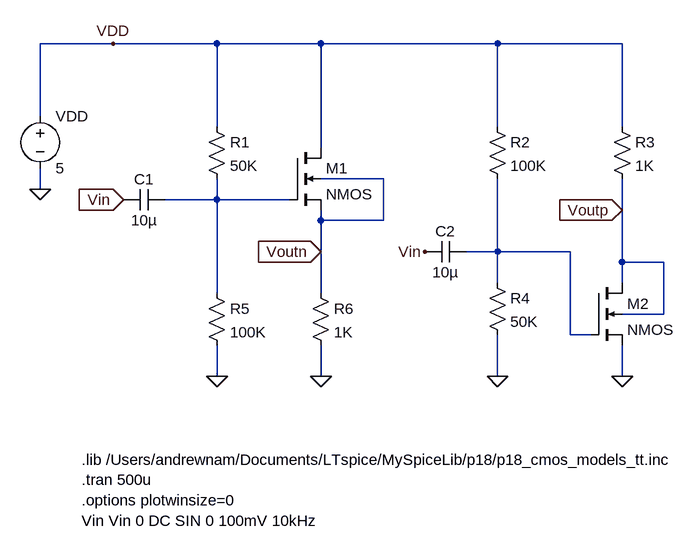
[diagram p0: schematic common_drain_amplifier.asc]
common_drain_amplifier.asc, the LTspice schematic file:
Version 4
SHEET 1 1116 800
WIRE 224 80 112 80
WIRE 384 80 224 80
WIRE 544 80 384 80
WIRE 816 80 544 80
WIRE 1008 80 816 80
WIRE 112 192 112 80
WIRE 384 208 384 80
WIRE 816 208 816 80
WIRE 1008 208 1008 80
WIRE 544 240 544 80
WIRE 640 288 544 288
WIRE 112 304 112 272
WIRE 384 320 384 288
WIRE 384 320 304 320
WIRE 496 320 384 320
WIRE 1008 336 1008 288
WIRE 544 352 544 336
WIRE 640 352 640 288
WIRE 640 352 544 352
WIRE 544 400 544 352
WIRE 816 400 816 288
WIRE 816 400 768 400
WIRE 928 400 816 400
WIRE 1008 416 1008 336
WIRE 1072 416 1008 416
WIRE 816 448 816 400
WIRE 1008 448 1008 416
WIRE 384 464 384 320
WIRE 544 464 544 400
WIRE 1072 496 1072 416
WIRE 1072 496 1008 496
WIRE 928 528 928 400
WIRE 960 528 928 528
WIRE 384 592 384 544
WIRE 544 592 544 544
WIRE 816 592 816 528
WIRE 1008 592 1008 544
FLAG 112 304 0
FLAG 384 592 0
FLAG 544 592 0
FLAG 816 592 0
FLAG 224 80 VDD
FLAG 1008 592 0
FLAG 240 320 Vin
IOPIN 240 320 In
FLAG 704 400 Vin
FLAG 1008 336 Voutp
IOPIN 1008 336 In
FLAG 544 400 Voutn
IOPIN 544 400 In
SYMBOL voltage 112 176 R0
SYMATTR InstName VDD
SYMATTR Value 5
SYMBOL res 368 192 R0
SYMATTR InstName R1
SYMATTR Value 50K
SYMBOL res 800 192 R0
SYMATTR InstName R2
SYMATTR Value 100K
SYMBOL res 992 192 R0
SYMATTR InstName R3
SYMATTR Value 1K
SYMBOL res 800 432 R0
SYMATTR InstName R4
SYMATTR Value 50K
SYMBOL res 368 448 R0
SYMATTR InstName R5
SYMATTR Value 100K
SYMBOL res 528 448 R0
SYMATTR InstName R6
SYMATTR Value 1K
SYMBOL nmos4 496 240 R0
SYMATTR InstName M1
SYMATTR Value2 l=0.18u w=10u
SYMBOL nmos4 960 448 R0
SYMATTR InstName M2
SYMATTR Value2 l=0.18u w=10u
SYMBOL cap 304 304 R90
WINDOW 0 0 32 VBottom 2
WINDOW 3 32 32 VTop 2
SYMATTR InstName C1
SYMATTR Value 10µ
SYMBOL cap 768 384 R90
WINDOW 0 0 32 VBottom 2
WINDOW 3 32 32 VTop 2
SYMATTR InstName C2
SYMATTR Value 10µ
TEXT 176 720 Left 2 !.lib /Users/andrewnam/Documents/LTspice/MySpiceLib/p18/p18_cmos_models_tt.inc\n.tran 500u\n.options plotwinsize=0\nVin Vin 0 DC SIN 0 100mV 10kHz

The netlist it stands for:
* common_drain_amplifier.asc
VDD VDD 0 5
R1 VDD N001 50K
R2 VDD N002 100K
R3 VDD Voutp 1K
R4 N002 0 50K
R5 N001 0 100K
R6 Voutn 0 1K
M1 VDD N001 Voutn Voutn NMOS l=0.18u w=10u
M2 Voutp N002 0 Voutp NMOS l=0.18u w=10u
C1 N001 Vin 10µ
C2 N002 Vin 10µ
.model NMOS NMOS
.model PMOS PMOS
.lib standard.mos
.lib /Users/andrewnam/Documents/LTspice/MySpiceLib/p18/p18_cmos_models_tt.inc
.tran 500u
.options plotwinsize=0
Vin Vin 0 DC SIN 0 100mV 10kHz
.backanno
.end